# EAGLE design T18_cad (EAGLE 7.1.0)
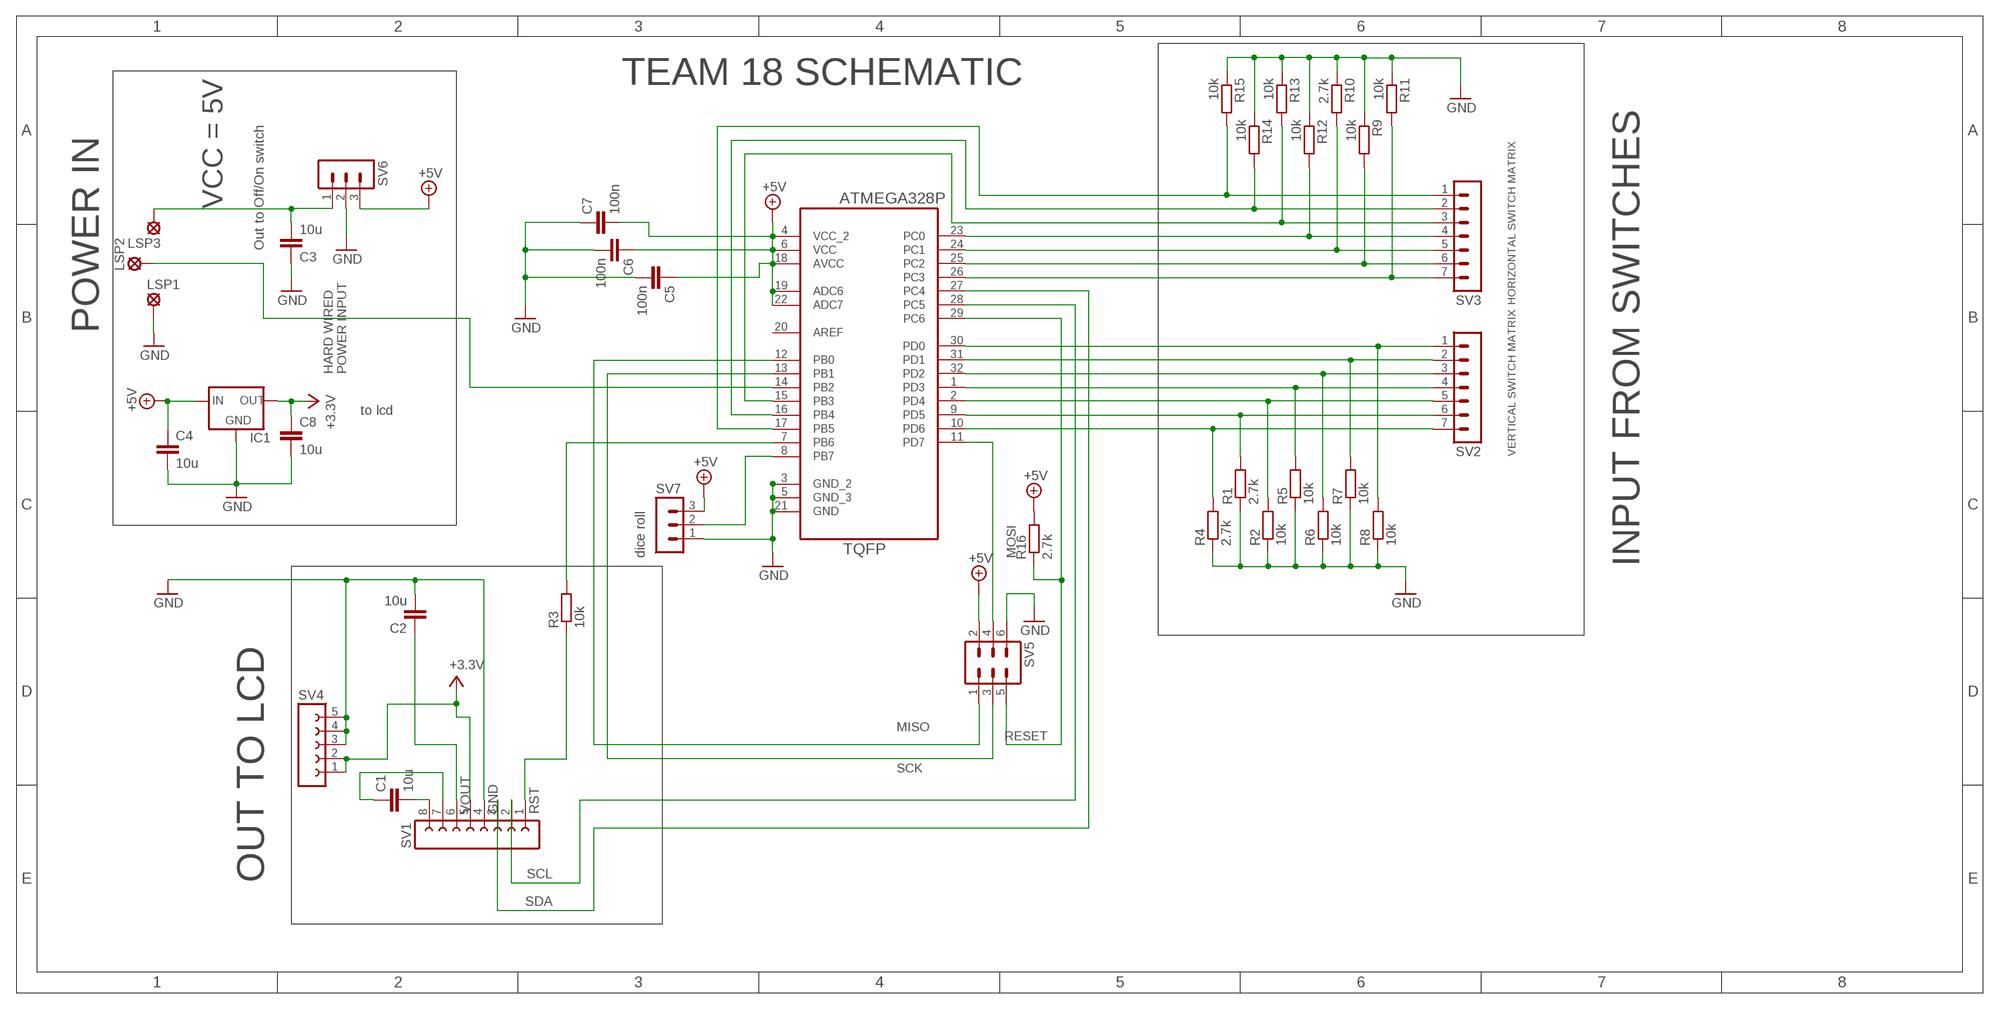
[diagram p0: schematic, sheet 1]

## Parts
C1  10u  CC0603  [C0603]
C2  10u  CC0603  [C0603]
C3  10u  CC0603  [C0603]
C4  10u  CC0603  [C0603]
C5  100n  CC0603  [C0603]
C6  100n  CC0603  [C0603]
C7  100n  CC0603  [C0603]
C8  10u  CC0603  [C0603]
IC1  78LXX  [78LXX]
LSP1  SE14  [SE14]
LSP2  SE14  [SE14]
LSP3  SE14  [SE14]
R1  2.7k  RR0603  [R0603]
R2  10k  RR0603  [R0603]
R3  10k  RR0603  [R0603]
R4  2.7k  RR0603  [R0603]
R5  10k  RR0603  [R0603]
R6  10k  RR0603  [R0603]
R7  10k  RR0603  [R0603]
R8  10k  RR0603  [R0603]
R9  10k  RR0603  [R0603]
R10  2.7k  RR0603  [R0603]
R11  10k  RR0603  [R0603]
R12  10k  RR0603  [R0603]
R13  10k  RR0603  [R0603]
R14  10k  RR0603  [R0603]
R15  10k  RR0603  [R0603]
R16  2.7k  RR0603  [R0603]
SV1  FE08-1  [FE08]
SV2  MA07-1  [MA07-1]
SV3  MA07-1  [MA07-1]
SV4  FE05-1  [FE05-1]
SV5  MA03-2  [MA03-2]
SV6  MA03-1  [MA03-1]
SV7  MA03-1  [MA03-1]
U1  ATMEGA328P-AU  [QFP80P900X900X120-32N]

## Nets
+3.3V: C8.1 IC1.OUT SV1.5 SV4.1 SV4.2
+5V: C4.1 C5.1 C6.1 C7.2 IC1.IN R16.2 SV5.2 SV6.3 SV7.3 U1.4(VCC_2) U1.6(VCC) U1.18(AVCC) U1.19(ADC6) U1.22(ADC7)
GND: C2.2 C3.1 C4.2 C5.2 C6.2 C7.1 C8.2 IC1.GND LSP1.MP R1.1 R2.1 R4.1 R5.1 R6.1 R7.1 R8.1 R9.1 R10.1 R11.1 R12.1 R13.1 R14.1 R15.1 SV1.4 SV4.3 SV4.4 SV4.5 SV5.6 SV6.2 SV7.1 U1.3(GND_2) U1.5(GND_3) U1.21(GND)
MISO: SV5.1 U1.12(PB0)
MOSI: SV5.4 U1.11(PD7)
N$1: R1.2 SV2.6 U1.9(PD5)
N$2: LSP2.MP U1.14(PB2)
N$4: R5.2 SV2.4 U1.1(PD3)
N$5: R2.2 SV2.5 U1.2(PD4)
N$6: R6.2 SV2.3 U1.32(PD2)
N$8: R7.2 SV2.2 U1.31(PD1)
N$9: R8.2 SV2.1 U1.30(PD0)
N$10: R4.2 SV2.7 U1.10(PD6)
N$11: R11.2 SV3.7 U1.26(PC3)
N$16: C1.2 SV1.8
N$17: C3.2 LSP3.MP SV6.1
N$18: R3.2 U1.7(PB6)
N$19: C1.1 SV1.7
N$20: R9.2 SV3.6 U1.25(PC2)
N$21: R10.2 SV3.5 U1.24(PC1)
N$22: R12.2 SV3.4 U1.23(PC0)
N$23: R13.2 SV3.3 U1.15(PB3)
N$24: R14.2 SV3.2 U1.16(PB4)
N$25: R15.2 SV3.1 U1.17(PB5)
RESET: R16.1 SV5.5 U1.29(PC6)
RST: R3.1 SV1.1
SCK: SV5.3 U1.13(PB1)
SCL: SV1.2 U1.28(PC5)
SDA: SV1.3 U1.27(PC4)
TESTPT: SV7.2 U1.8(PB7)
VOUT: C2.1 SV1.6
Unconnected: U1.20(AREF)

## Notes on the sheet
- TEAM 18 SCHEMATIC
- VCC = 5V
- Out to Off/On switch
- HORIZONTAL SWITCH MATRIX
- POWER IN
- HARD WIRED
  POWER INPUT
- to lcd
- VERTICAL SWITCH MATRIX
- dice roll
- INPUT FROM SWITCHES
- OUT TO LCD

## Library data of the parts
C1-C8 = eagle-ltspice:C: CAPACITOR, European symbol; SPICEMODEL: NONE; SPICEPREFIX: C
IC1 = v-reg:78LXX: VOLTAGE REGULATOR
LSP1-LSP3 = solpad:SE14: SOLDER PAD E1553, drill 1,4mm, distributor Buerklin, 07F820
R1-R16 = eagle-ltspice:R: RESISTOR, European symbol; SPICEMODEL: NONE; SPICEPREFIX: R
SV1 = con-lsta:FE08-1: FEMALE HEADER; OC_FARNELL: unknown; OC_NEWARK: unknown
SV2 SV3 = con-lstb:MA07-1: PIN HEADER; OC_FARNELL: unknown; OC_NEWARK: unknown
SV4 = con-lsta:FE05-1: FEMALE HEADER; OC_FARNELL: unknown; OC_NEWARK: unknown
SV5 = con-lstb:MA03-2: PIN HEADER; OC_FARNELL: unknown; OC_NEWARK: unknown
SV6 SV7 = con-lstb:MA03-1: PIN HEADER; OC_FARNELL: unknown; OC_NEWARK: unknown
U1 = Ava:ATMEGA328P-AU; DESCRIPTION: 8-bit Microcontroller with In-System Programmable Flash; MPN: ATMEGA328P-AU; OC_FARNELL: 1715486; OC_NEWARK: 14R4631; PACKAGE: TQFP-32; SUPPLIER: Atmel

## Board
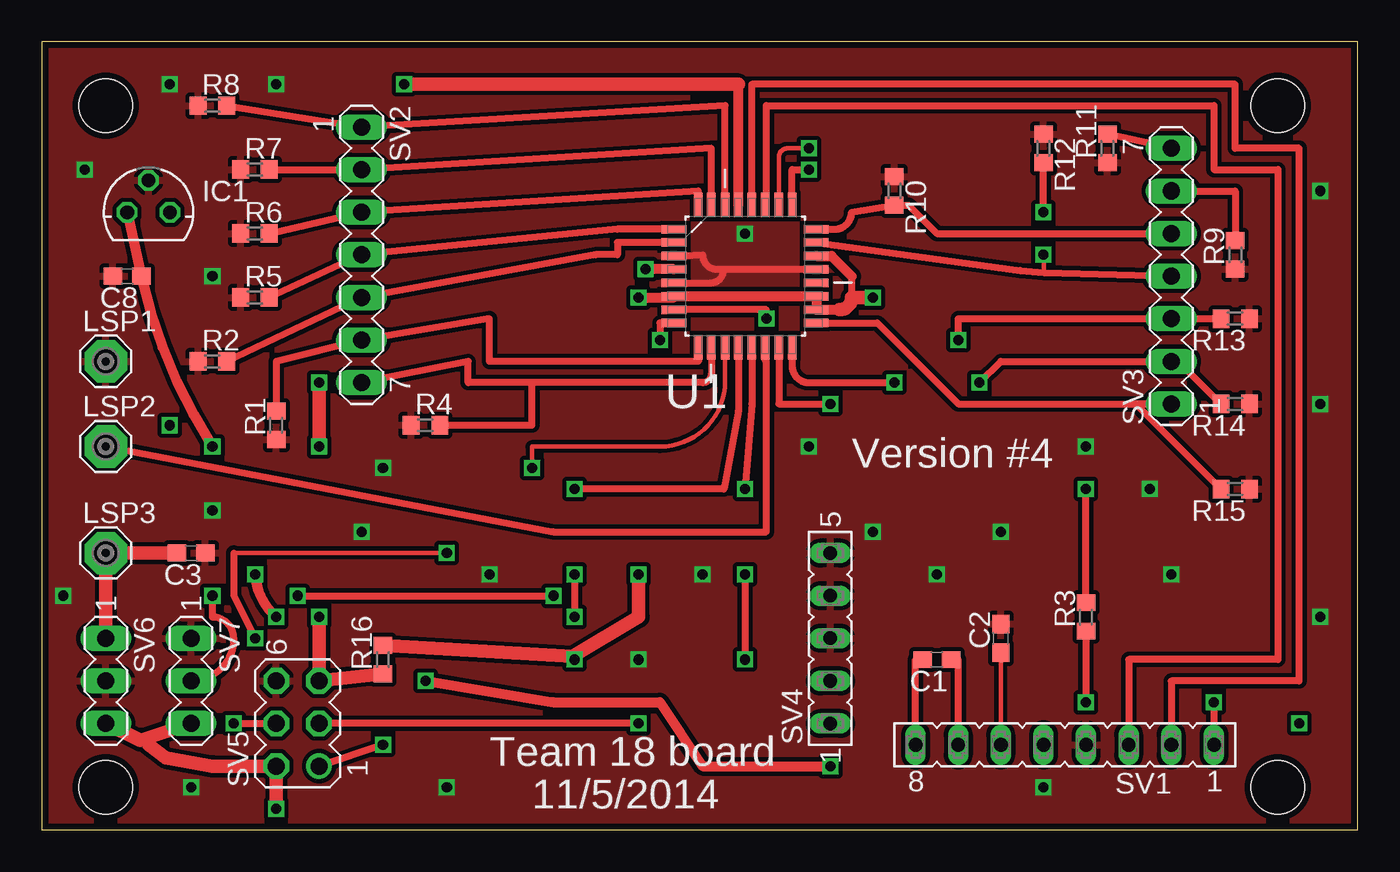
[diagram p1: board, top side]
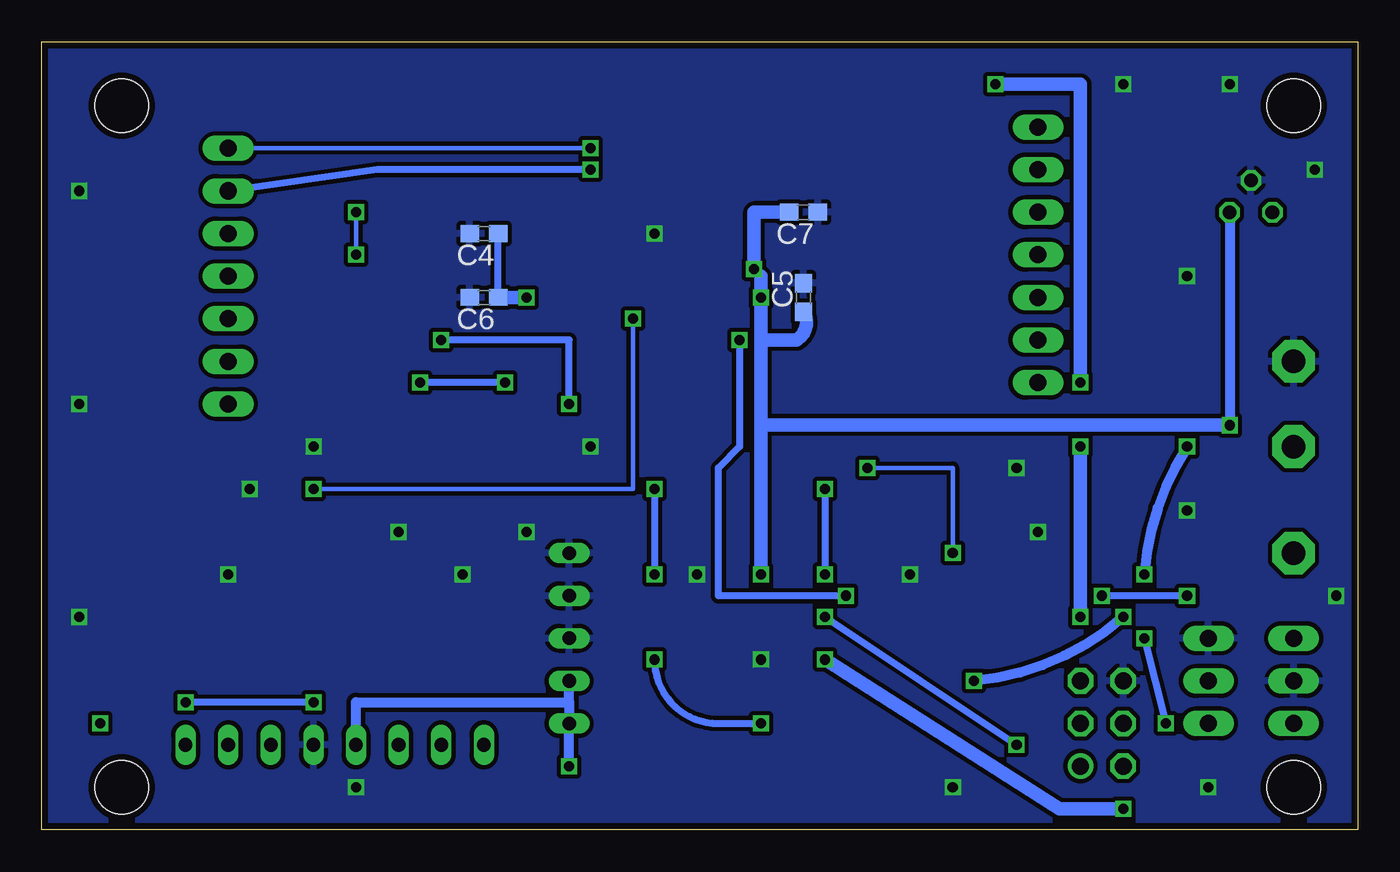
[diagram p2: board, bottom side, seen from below]

Size 78.41 x 46.98 mm. Coordinates in mm from the lower left corner, seen from the top.
Outline: 0,0 78.41,0 78.41,46.98 0,46.98 0,0
Copper layers (1*16): Top 0.0356mm / dielectric 1.5011mm / Bottom 0.0356mm
Design rules "OSH-Park-2-layer": minimum track width 6mil, minimum drill 13mil, track to track 6mil, track to pad 6mil, pad to pad 6mil, via to via 6mil, smd to smd 6mil, copper to edge 15mil, drill to drill 6mil, minimum pad ring 7mil, minimum via ring 7mil, stop-mask expansion 3mil, vias tented up to drill 0mil, thermal gap 10mil
Holes 3.17 mm at 3.81,43.18 3.81,2.54 73.66,2.54 73.66,43.18

### Footprints (pad centres in the part's own frame; a part is rotated, then mirrored left to right if it is on the bottom)
C0603 = smd 1.1 x 1: 1 -0.85,0; 2 0.85,0
78LXX = drill 0.813 octagon: GND 0,1.905; IN 1.27,0; OUT -1.27,0
SE14 = drill 1.397 pad 2.54 octagon: MP 0,0
R0603 = smd 1 x 1.1: 1 -0.85,0; 2 0.85,0
FE08 = drill 0.813 long: 1 -8.89,0; 2 -6.35,0; 3 -3.81,0; 4 -1.27,0; 5 1.27,0; 6 3.81,0; 7 6.35,0; 8 8.89,0
MA07-1 = drill 1.016 long: 1 -7.62,0; 2 -5.08,0; 3 -2.54,0; 4 0,0; 5 2.54,0; 6 5.08,0; 7 7.62,0
FE05-1 = drill 0.813 long: 1 -5.08,0; 2 -2.54,0; 3 0,0; 4 2.54,0; 5 5.08,0
MA03-2 = drill 1.016: 1 -2.54,-1.27 | drill 1.016 octagon: 2 -2.54,1.27; 3 0,-1.27; 4 0,1.27; 5 2.54,-1.27; 6 2.54,1.27
MA03-1 = drill 1.016 long: 1 -2.54,0; 2 0,0; 3 2.54,0
QFP80P900X900X120-32N = smd 1.473 x 0.508: 1 -4.242,2.794; 2 -4.242,2.007; 3 -4.242,1.194; 4 -4.242,0.406; 5 -4.242,-0.406; 6 -4.242,-1.194; 7 -4.242,-2.007; 8 -4.242,-2.794; 17 4.242,-2.794; 18 4.242,-2.007; 19 4.242,-1.194; 20 4.242,-0.406; 21 4.242,0.406; 22 4.242,1.194; 23 4.242,2.007; 24 4.242,2.794 | smd 0.508 x 1.473: 9 -2.794,-4.242; 10 -2.007,-4.242; 11 -1.194,-4.242; 12 -0.406,-4.242; 13 0.406,-4.242; 14 1.194,-4.242; 15 2.007,-4.242; 16 2.794,-4.242; 25 2.794,4.242; 26 2.007,4.242; 27 1.194,4.242; 28 0.406,4.242; 29 -0.406,4.242; 30 -1.194,4.242; 31 -2.007,4.242; 32 -2.794,4.242

### Placement (x,y rotation side)
C1  53.34,10.16 180 top
C2  57.15,11.43 90 top
C3  8.89,16.51 180 top
C4  52.07,35.56 180 bottom
C5  33.02,31.75 90 bottom
C6  52.07,31.75 180 bottom
C7  33.02,36.83 180 bottom
C8  5.08,33.02 180 top
IC1  6.35,36.83 0 top
LSP1  3.81,27.94 0 top
LSP2  3.81,22.86 0 top
LSP3  3.81,16.51 0 top
R1  13.97,24.13 90 top
R2  10.16,27.94 0 top
R3  62.23,12.7 90 top
R4  22.86,24.13 0 top
R5  12.7,31.75 0 top
R6  12.7,35.56 0 top
R7  12.7,39.37 0 top
R8  10.16,43.18 0 top
R9  71.12,34.29 90 top
R10  50.8,38.1 270 top
R11  63.5,40.64 90 top
R12  59.69,40.64 270 top
R13  71.12,30.48 180 top
R14  71.12,25.4 180 top
R15  71.12,20.32 180 top
R16  20.32,10.16 90 top
SV1  60.96,5.08 180 top
SV2  19.05,34.29 270 top
SV3  67.31,33.02 90 top
SV4  46.99,11.43 90 top
SV5  15.24,6.35 90 top
SV6  3.81,8.89 270 top
SV7  8.89,8.89 270 top
U1  41.91,33.02 0 top

### Tracks (layer width: path | path; a pad name or v marks a point on that pad's centre or on a via)
+3.3V  (via drill 0.6)
  Top 0.61: IC1.OUT C8.1 arc20 v10.16,22.86 | v12.7,15.24 arc45 v13.97,12.7 | v22.86,8.89 30.48,7.62 36.83,7.62 39.37,3.81 v46.99,3.81
  Bottom 0.61: SV1.5 59.69,7.62 46.99,7.62 | 46.99,7.62 SV4.1 v46.99,3.81 | 46.99,7.62 SV4.2 | v10.16,22.86 arc-28 v12.7,15.24 | v13.97,12.7 arc36 v22.86,8.89
+5V  (via drill 0.6)
  Top 0.406: 37.67,31.75 U1.6 | 5.84,5.33 6.35,5.08 | 48.26,33.02 48.26,31.75
  Top 0.61: v35.56,31.75 37.67,31.75 | U1.6 U1.19 U1.18 47.52,31.01 | U1.4 v35.97,33.43 | U1.22 47.07,34.21 48.26,33.02
  Top 0.813: v35.56,15.24 35.56,12.7 31.64,10.35 | v13.97,1.27 SV5.2 10.16,3.81 7.37,4.32 6.35,5.08 | v31.75,10.16 31.64,10.35 | SV6.3 5.84,5.33 SV7.3 | R16.2 31.64,10.35 | 47.52,31.01 arc90 48.26,31.75 v49.53,31.75
  Bottom 0.406: v35.97,33.43 35.56,33.02 | C6.1 C4.1
  Bottom 0.61: IC1.IN v7.62,24.13
  Bottom 0.813: v35.56,15.24 35.56,24.13 | 35.56,24.13 35.56,29.21 | 35.56,29.21 v35.56,31.75 35.56,33.02 | v7.62,24.13 35.56,24.13 | v31.75,10.16 17.78,1.27 v13.97,1.27 | C6.1 v49.53,31.75 | C5.1 arc90 33.44,29.21 35.56,29.21 | C7.2 35.97,36.83 v35.97,33.43
GND  (via drill 0.6)
  Top 0.406: U1.3 39.37,34.29 arc90 40.23,33.43 40.64,33.43 | 40.64,33.43 U1.21 | U1.5 39.83,32.61 arc90 40.64,33.43
  other vias: 45.72,22.86 76.2,25.4 66.04,20.32 76.2,12.7 62.23,22.86 67.31,15.24 76.2,38.1 57.15,17.78 49.53,17.78 59.69,2.54 24.13,2.54 35.56,10.16 39.37,15.24 26.67,15.24 8.89,2.54 1.27,13.97 10.16,19.05 19.05,17.78 10.16,33.02 2.54,39.37 7.62,44.45 53.34,15.24 41.91,35.56 13.97,44.45 20.32,21.59
  pour Bottom (isolate 0.254): 0,46.99 78.74,46.99 78.74,0 0,0
  pour Top (isolate 0.254): 0,46.99 78.74,46.99 78.74,0 0,0
MISO  (via drill 0.6)
  Top 0.406: U1.12 41.5,24.99 40.64,20.32 v31.75,20.32 | v20.32,5.08 SV5.1 | v31.75,15.24 v31.75,12.7
  Bottom 0.406: v31.75,12.7 v20.32,5.08 | v31.75,20.32 v31.75,15.24
MOSI  (via drill 0.6)
  Top 0.254: U1.11 40.72,26.75 arc-90 36.83,22.86 29.21,22.86 v29.21,21.59 | v24.13,16.51 11.43,16.51 | 12.7,6.35 SV5.4
  Top 0.406: 11.43,16.51 11.43,13.97 v12.7,11.43 | v11.43,6.35 SV5.4
  Bottom 0.254: v29.21,21.59 24.13,21.59 v24.13,16.51
  Bottom 0.406: v12.7,11.43 v11.43,6.35
N$1
  Top 0.406: U1.9 39.12,27.94 26.67,27.94 26.67,30.48 SV2.6 13.97,27.94 R1.2
N$2
  Top 0.406: LSP2.MP 30.48,17.78 43.18,17.78 43.18,27.94 43.1,28.02 U1.14
N$4
  Top 0.406: U1.1 34.29,35.81 SV2.4 R5.2
N$5
  Top 0.406: R2.2 SV2.5 33.02,34.29 34.29,34.29 34.29,35.03 U1.2
N$6
  Top 0.406: U1.32 39.12,38.1 SV2.3 R6.2
N$8
  Top 0.406: U1.31 39.9,40.64 SV2.2 R7.2
N$9
  Top 0.406: U1.30 40.72,43.18 SV2.1 R8.2
N$10
  Top 0.406: U1.10 39.9,27.2 arc-90 39.37,26.67 29.21,26.67 | 29.21,26.67 25.4,26.67 25.4,27.94 SV2.7 | R4.2 29.21,24.13 29.21,26.67
N$11  (via drill 0.6)
  Top 0.254: U1.26 43.92,40.11 arc-90 44.45,40.64 v45.72,40.64
  Top 0.406: SV3.7 R11.2
  Bottom 0.254: v45.72,40.64 SV3.7
N$16
  Top 0.406: SV1.8 52.07,10.16 C1.2
N$17
  Top 0.813: C3.2 LSP3.MP SV6.1
N$18  (via drill 0.6)
  Top 0.406: R3.2 v62.23,20.32 | v43.18,30.48 43.18,31.01 U1.7
  Bottom 0.254: v62.23,20.32 43.18,20.32 v43.18,30.48
N$19
  Top 0.406: SV1.7 54.61,10.16 C1.1
N$20  (via drill 0.6)
  Top 0.406: U1.25 44.7,39.37 v45.72,39.37 | SV3.6 71.12,38.1 R9.2
  Bottom 0.406: v45.72,39.37 58.42,39.37 SV3.6
N$21
  Top 0.406: U1.24 47.24,35.81 arc90 48.26,36.83 R10.2 51.65,37.25 53.34,35.56 SV3.5
N$22  (via drill 0.6)
  Top 0.254: v59.69,34.29 59.71,34.29 59.71,33.23
  Top 0.406: U1.23 58.3,33.35 59.71,33.23 SV3.4 | v59.69,36.83 R12.2
  Bottom 0.254: v59.69,36.83 v59.69,34.29
N$23  (via drill 0.6)
  Top 0.406: U1.15 43.92,25.4 v46.99,25.4 | v54.61,29.21 54.61,30.48 SV3.3 R13.2
  Bottom 0.406: v46.99,25.4 46.99,29.21 v54.61,29.21
N$24  (via drill 0.6)
  Top 0.406: U1.16 44.7,27.69 arc90 45.72,26.67 v50.8,26.67 | v55.88,26.67 57.15,27.94 SV3.2 67.73,27.94 R14.2
  Bottom 0.406: v50.8,26.67 v55.88,26.67
N$25
  Top 0.406: U1.17 49.78,30.23 54.61,25.4 SV3.1 65.19,25.4 R15.2
N$78  (via drill 0.6)
  other vias: 74.93,6.35
RESET  (via drill 0.6)
  Top 0.61: U1.29 41.5,44.45
  Top 0.813: 41.5,44.45 v21.59,44.45 | v16.51,26.67 v16.51,22.86 | v16.51,12.7 SV5.5 R16.1
  Bottom 0.813: v21.59,44.45 16.51,44.45 v16.51,26.67 | v16.51,22.86 v16.51,12.7
RST  (via drill 0.6)
  Top 0.406: R3.1 v62.23,7.62 | v69.85,7.62 SV1.1
  Bottom 0.406: v62.23,7.62 v69.85,7.62
SCK  (via drill 0.6)
  Top 0.406: U1.13 42.32,25.4 v41.91,20.32 | v41.91,15.24 v41.91,10.16 | v35.56,6.35 SV5.3
  Bottom 0.406: v41.91,20.32 v41.91,15.24 | v41.91,10.16 arc-90 38.1,6.35 v35.56,6.35
SCL
  Top 0.406: U1.28 42.32,44.45 71.12,44.45 71.12,40.64 74.93,40.64 74.93,8.89 67.31,8.89 SV1.2
SDA
  Top 0.406: SV1.3 64.77,10.16 73.66,10.16 73.66,39.37 69.85,39.37 69.85,43.18 43.18,43.18 43.18,37.26 U1.27
TESTPT  (via drill 0.6)
  Top 0.406: v15.24,13.97 v30.48,13.97 | U1.8 36.83,30.23 v36.83,29.21 | v10.16,13.97 10.16,12.7 arc-90 11.43,11.43 arc-90 SV7.2
  Bottom 0.406: v10.16,13.97 v15.24,13.97 | v30.48,13.97 38.1,13.97 38.1,21.59 36.83,22.86 v36.83,29.21
VOUT
  Top 0.254: SV1.6 C2.1

### Text on the board
tNames: Version #4 | Team 18 board | 11/5/2014